# Altium schematic sheet 01 top.SchDoc
size A3; SheetNumber: 1; SheetTotal: 16
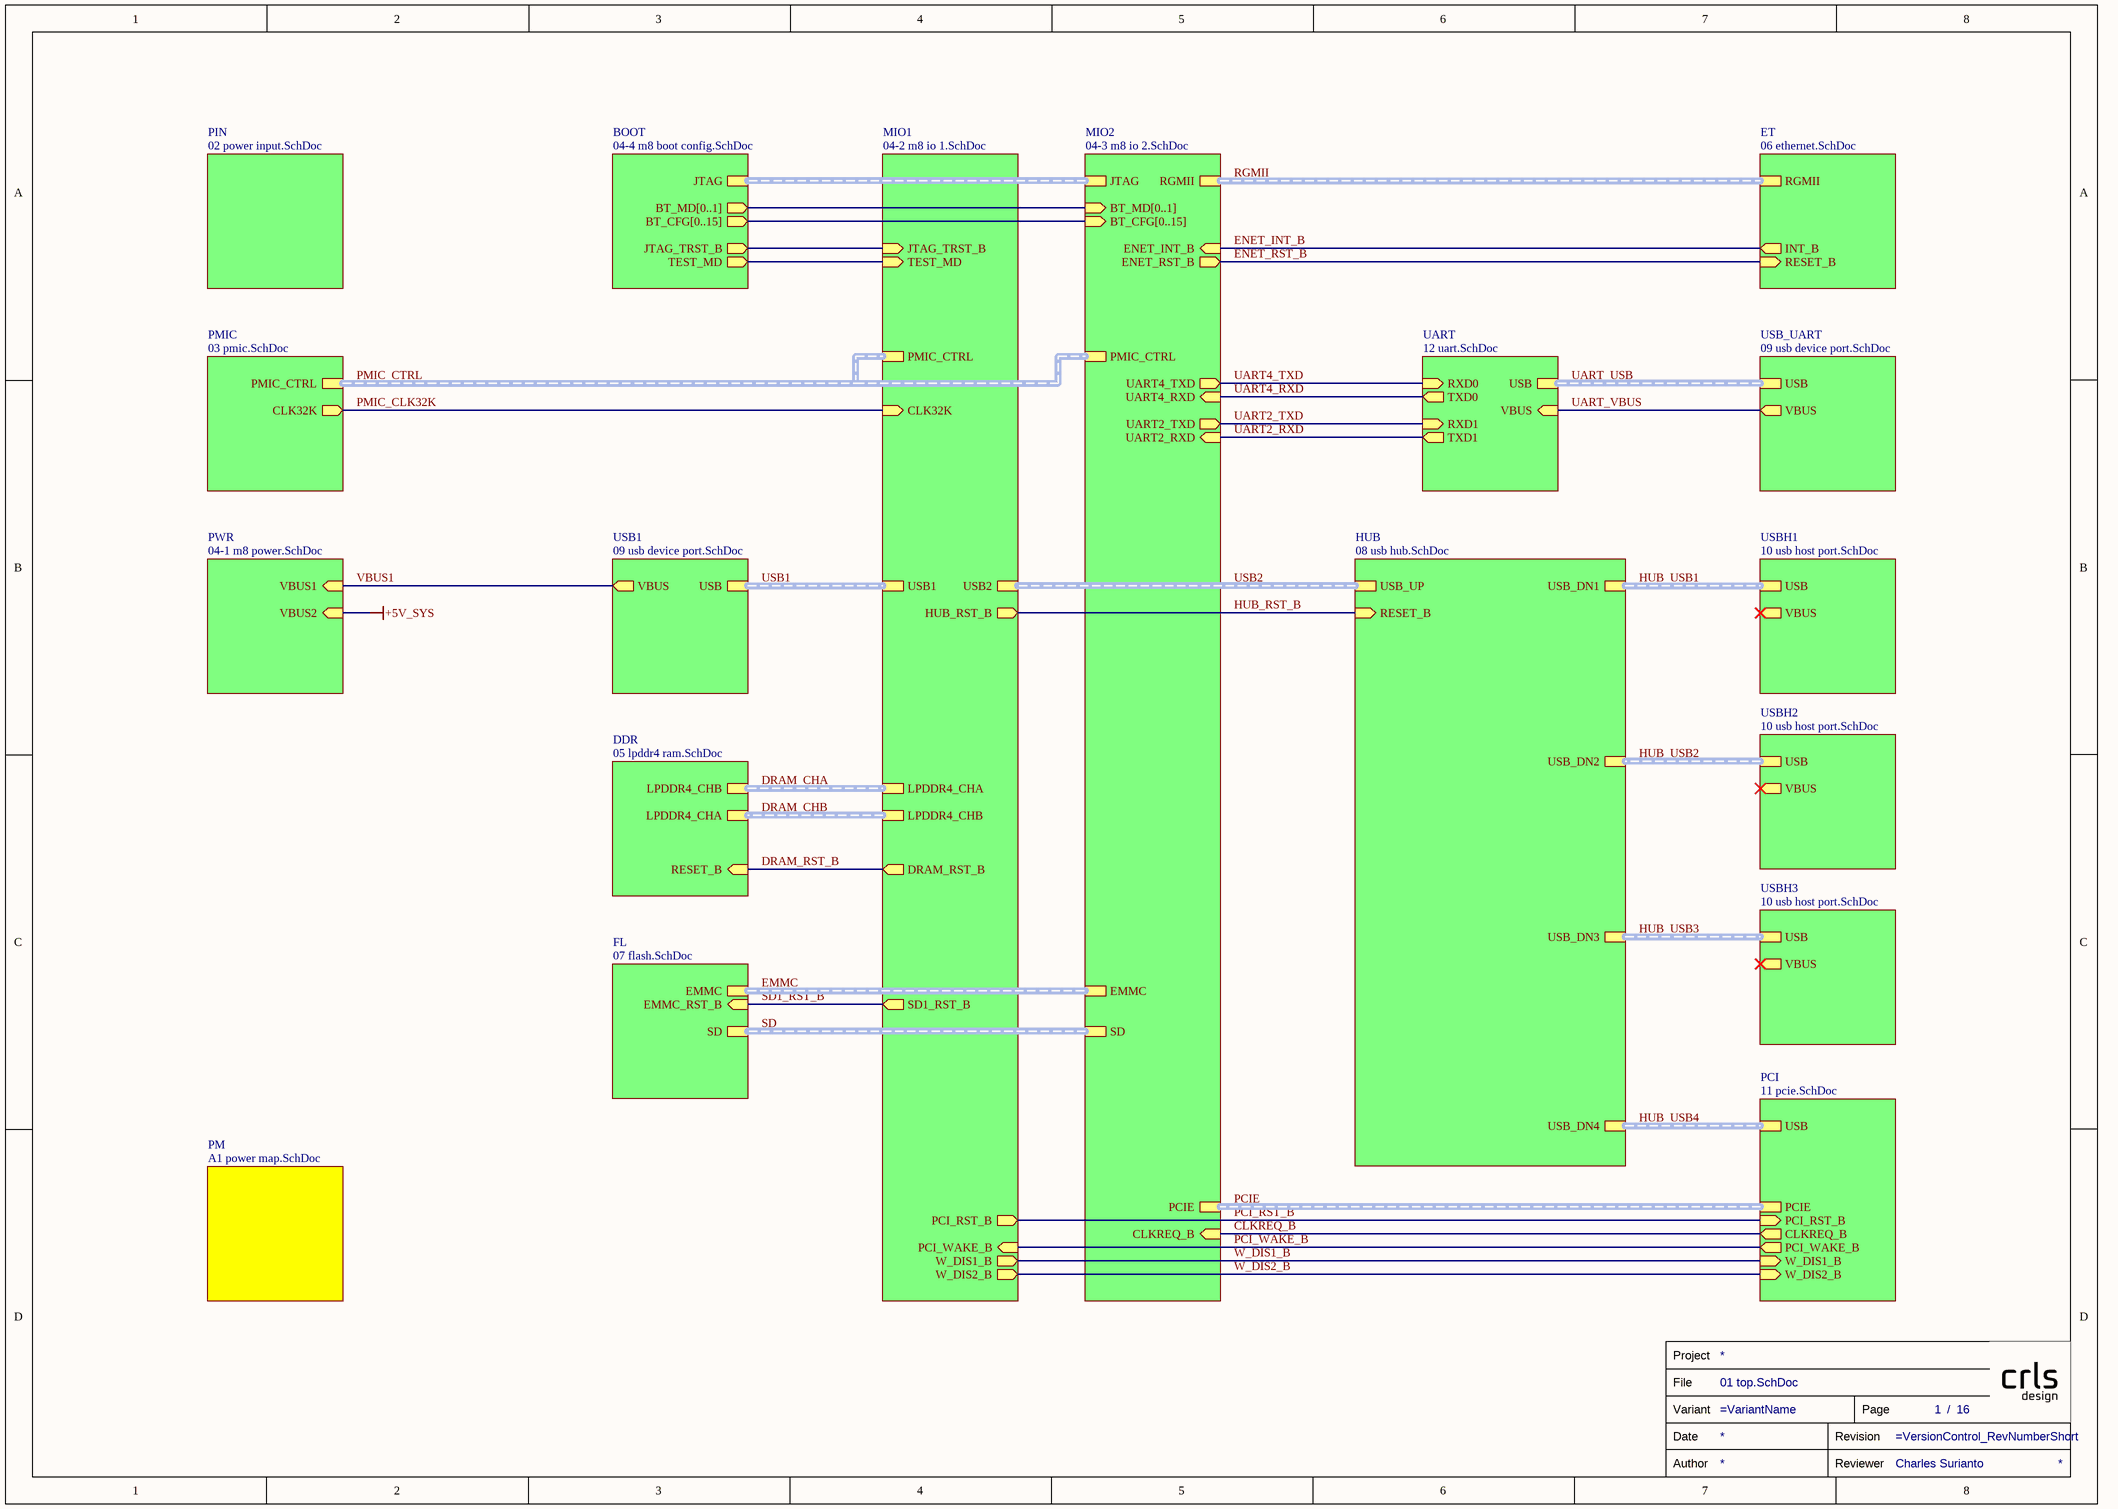
[diagram p0: 01 top.SchDoc]

## Parts
TB  Reviewer: Charles Surianto  (hidden comment: TITLE_BLOCK)  (graphical)

## Sub-sheets
BOOT = 04-4 m8 boot config.SchDoc: BT_CFG[0..15] (out), BT_MD[0..1] (out), JTAG (harness JTAG), JTAG_TRST_B (out), TEST_MD (out)
DDR = 05 lpddr4 ram.SchDoc: RESET_B (in), LPDDR4_CHB (harness LPDDR4_CH), LPDDR4_CHA (harness LPDDR4_CH)
ET = 06 ethernet.SchDoc: RESET_B (in), INT_B (out), RGMII (harness RGMII)
FL = 07 flash.SchDoc: EMMC_RST_B (in), EMMC (harness EMMC), SD (harness SD)
HUB = 08 usb hub.SchDoc: USB_UP (harness USB), USB_DN1 (harness USB), USB_DN4 (harness USB), USB_DN3 (harness USB), USB_DN2 (harness USB), RESET_B (in)
MIO1 = 04-2 m8 io 1.SchDoc: CLK32K (in), LPDDR4_CHA (harness LPDDR4_CH), DRAM_RST_B (out), LPDDR4_CHB (harness LPDDR4_CH), PMIC_CTRL (harness PMIC_CTRL), SD1_RST_B (out), USB1 (harness USB), USB2 (harness USB), JTAG_TRST_B (in), TEST_MD (in), HUB_RST_B (out), PCI_RST_B (out), PCI_WAKE_B (in), W_DIS1_B (out), W_DIS2_B (out)
MIO2 = 04-3 m8 io 2.SchDoc: PMIC_CTRL (harness PMIC_CTRL), PCIE (harness PCIE), EMMC (harness EMMC), SD (harness SD), RGMII (harness RGMII), BT_CFG[0..15] (in), BT_MD[0..1] (in), UART4_TXD (out), UART4_RXD (in), UART2_TXD (out), UART2_RXD (in), JTAG (harness JTAG), ENET_INT_B (in), ENET_RST_B (out), CLKREQ_B (in)
PCI = 11 pcie.SchDoc: USB (harness USB), PCIE (harness PCIE), CLKREQ_B (out), PCI_RST_B (in), W_DIS1_B (in), W_DIS2_B (in), PCI_WAKE_B (out)
PIN = 02 power input.SchDoc: no entries
PM = A1 power map.SchDoc: no entries
PMIC = 03 pmic.SchDoc: PMIC_CTRL (harness PMIC_CTRL), CLK32K (out)
PWR = 04-1 m8 power.SchDoc: VBUS1 (in), VBUS2 (in)
UART = 12 uart.SchDoc: VBUS (in), RXD1 (in), USB (harness USB), RXD0 (in), TXD0 (out), TXD1 (out)
USB1 = 09 usb device port.SchDoc: USB (harness USB), VBUS (out)
USB_UART = 09 usb device port.SchDoc: USB (harness USB), VBUS (out)
USBH1 = 10 usb host port.SchDoc: USB (harness USB), VBUS (out)
USBH2 = 10 usb host port.SchDoc: USB (harness USB), VBUS (out)
USBH3 = 10 usb host port.SchDoc: USB (harness USB), VBUS (out)

## Nets
+5V_SYS: sheet PWR/VBUS2
CLKREQ_B: sheet PCI/CLKREQ_B, sheet MIO2/CLKREQ_B
DRAM_RST_B: sheet MIO1/DRAM_RST_B, sheet DDR/RESET_B
ENET_INT_B: sheet ET/INT_B, sheet MIO2/ENET_INT_B
ENET_RST_B: sheet ET/RESET_B, sheet MIO2/ENET_RST_B
HUB_RST_B: sheet MIO1/HUB_RST_B, sheet HUB/RESET_B
PCI_RST_B: sheet MIO1/PCI_RST_B, sheet PCI/PCI_RST_B
PCI_WAKE_B: sheet MIO1/PCI_WAKE_B, sheet PCI/PCI_WAKE_B
PMIC_CLK32K: sheet PMIC/CLK32K, sheet MIO1/CLK32K
SD1_RST_B: sheet MIO1/SD1_RST_B, sheet FL/EMMC_RST_B
UART2_RXD: sheet MIO2/UART2_RXD, sheet UART/TXD1
UART2_TXD: sheet MIO2/UART2_TXD, sheet UART/RXD1
UART4_RXD: sheet MIO2/UART4_RXD, sheet UART/TXD0
UART4_TXD: sheet MIO2/UART4_TXD, sheet UART/RXD0
UART_VBUS: sheet USB_UART/VBUS, sheet UART/VBUS
VBUS1: sheet PWR/VBUS1, sheet USB1/VBUS
W_DIS1_B: sheet MIO1/W_DIS1_B, sheet PCI/W_DIS1_B
W_DIS2_B: sheet MIO1/W_DIS2_B, sheet PCI/W_DIS2_B
(unnamed): sheet MIO1/JTAG_TRST_B, sheet BOOT/JTAG_TRST_B
(unnamed): sheet MIO1/TEST_MD, sheet BOOT/TEST_MD

## Buses and harness runs
bus sheet BOOT/BT_CFG[0..15] = sheet MIO2/BT_CFG[0..15]
bus sheet BOOT/BT_MD[0..1] = sheet MIO2/BT_MD[0..1]
harness DRAM_CHA = sheet DDR/LPDDR4_CHB = sheet MIO1/LPDDR4_CHA
harness DRAM_CHB = sheet DDR/LPDDR4_CHA = sheet MIO1/LPDDR4_CHB
harness EMMC = sheet FL/EMMC = sheet MIO2/EMMC
harness HUB_USB1 = sheet HUB/USB_DN1 = sheet USBH1/USB
harness HUB_USB2 = sheet HUB/USB_DN2 = sheet USBH2/USB
harness HUB_USB3 = sheet HUB/USB_DN3 = sheet USBH3/USB
harness HUB_USB4 = sheet HUB/USB_DN4 = sheet PCI/USB
harness PCIE = sheet MIO2/PCIE = sheet PCI/PCIE
harness PMIC_CTRL = sheet MIO1/PMIC_CTRL = sheet MIO2/PMIC_CTRL = sheet PMIC/PMIC_CTRL
harness RGMII = sheet ET/RGMII = sheet MIO2/RGMII
harness SD = sheet FL/SD = sheet MIO2/SD
harness sheet BOOT/JTAG = sheet MIO2/JTAG
harness UART_USB = sheet UART/USB = sheet USB_UART/USB
harness USB1 = sheet MIO1/USB1 = sheet USB1/USB
harness USB2 = sheet HUB/USB_UP = sheet MIO1/USB2

## Notes on the sheet
- (in symbol TITLE_BLOCK) Project; File; Variant; Page; /; Date; Revision; Author; Reviewer

## Library data of the parts
TB = TITLE_BLOCK: Review Date: *